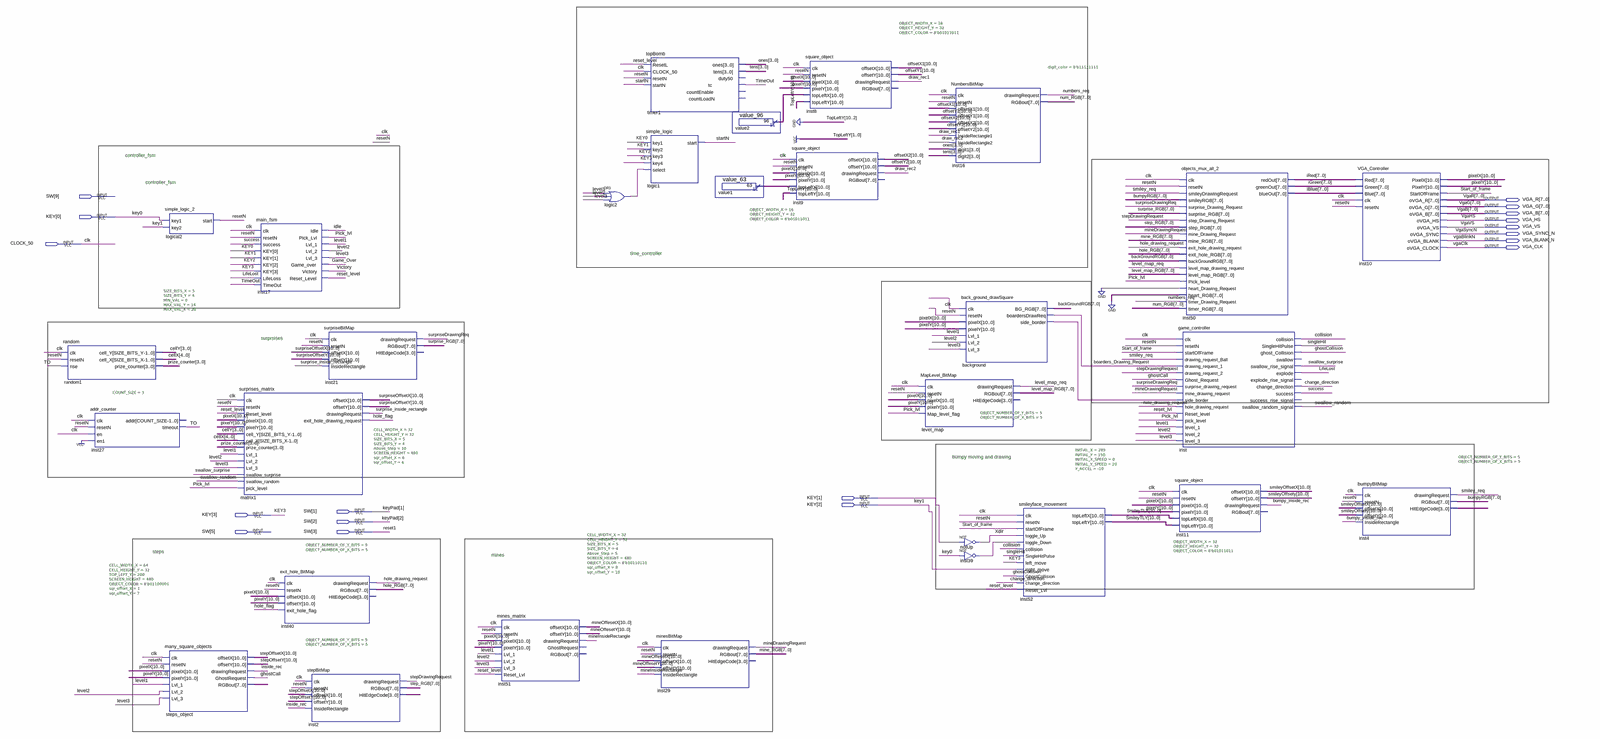
[diagram p0: schematic sheet, whole]
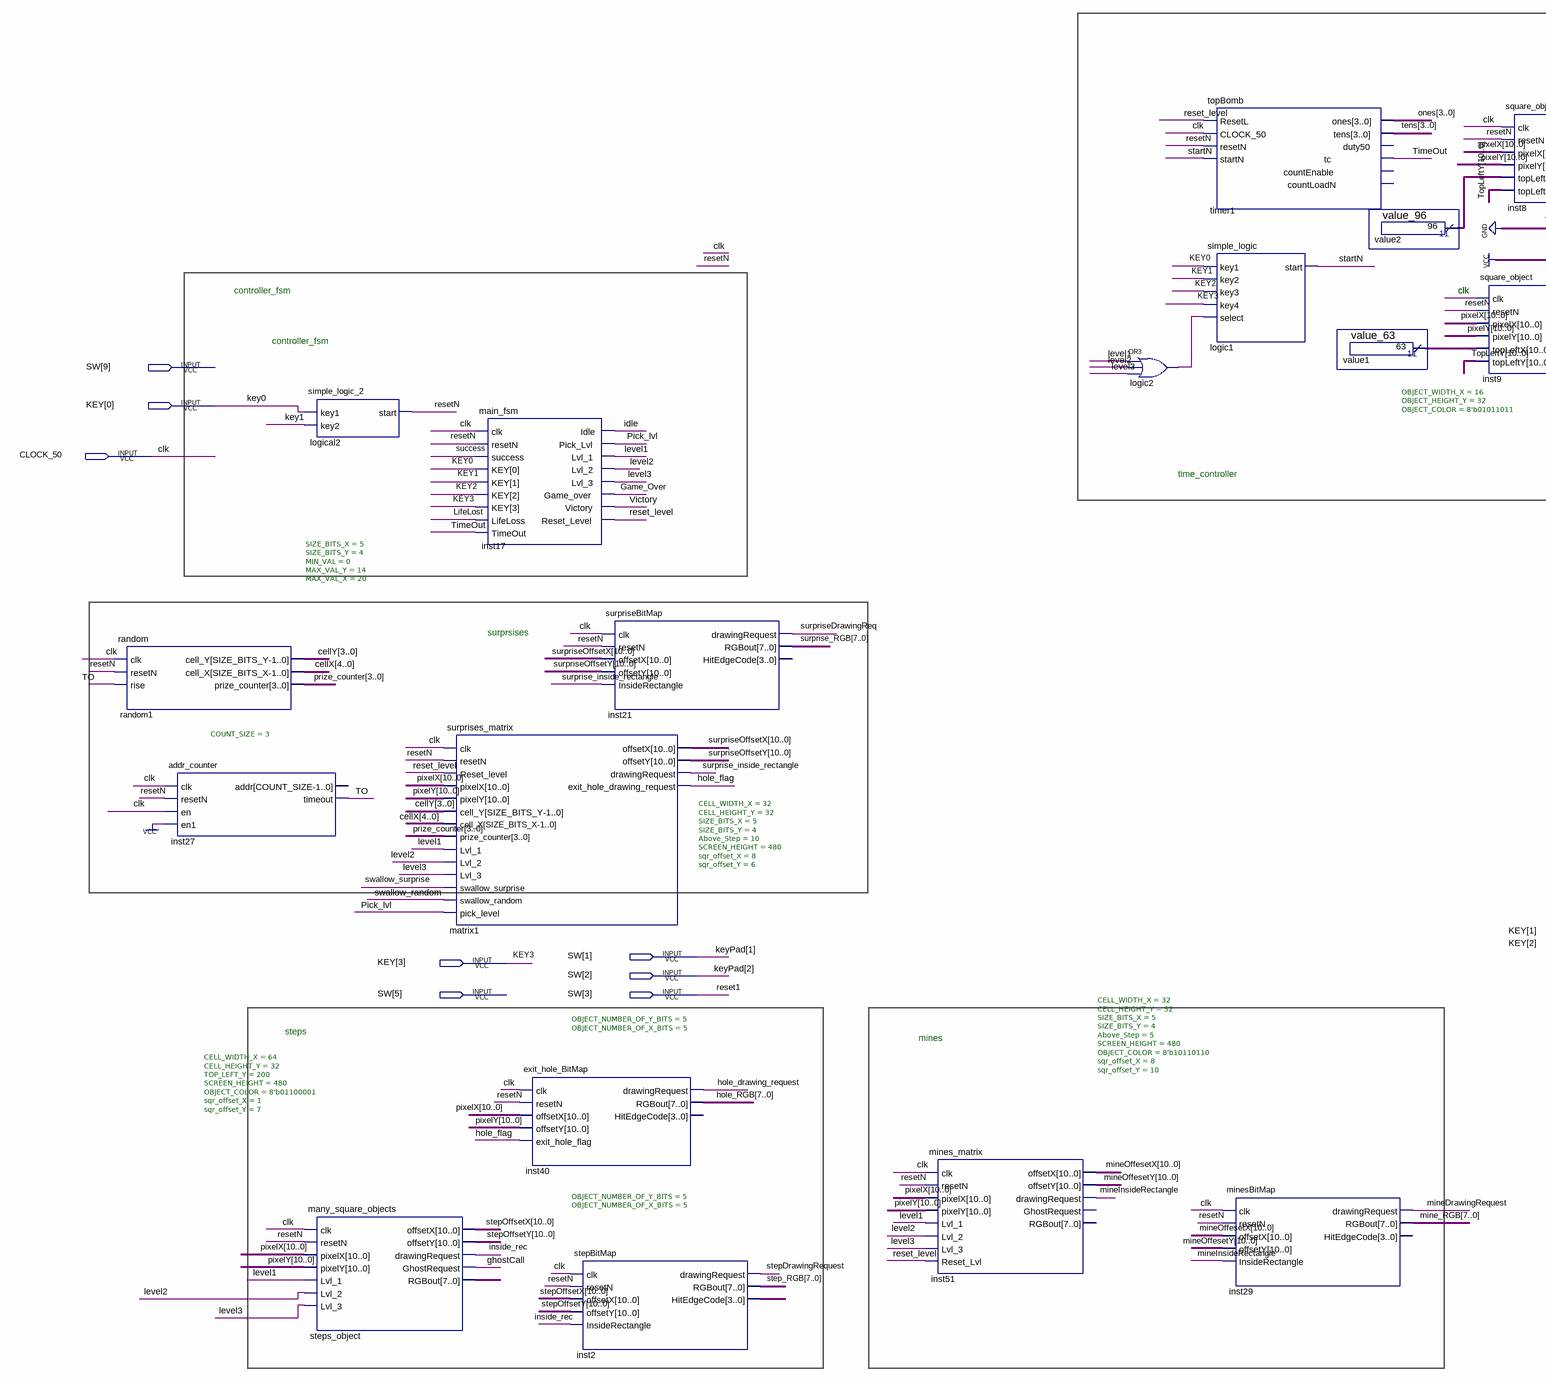
[diagram p1: schematic sheet, left part]
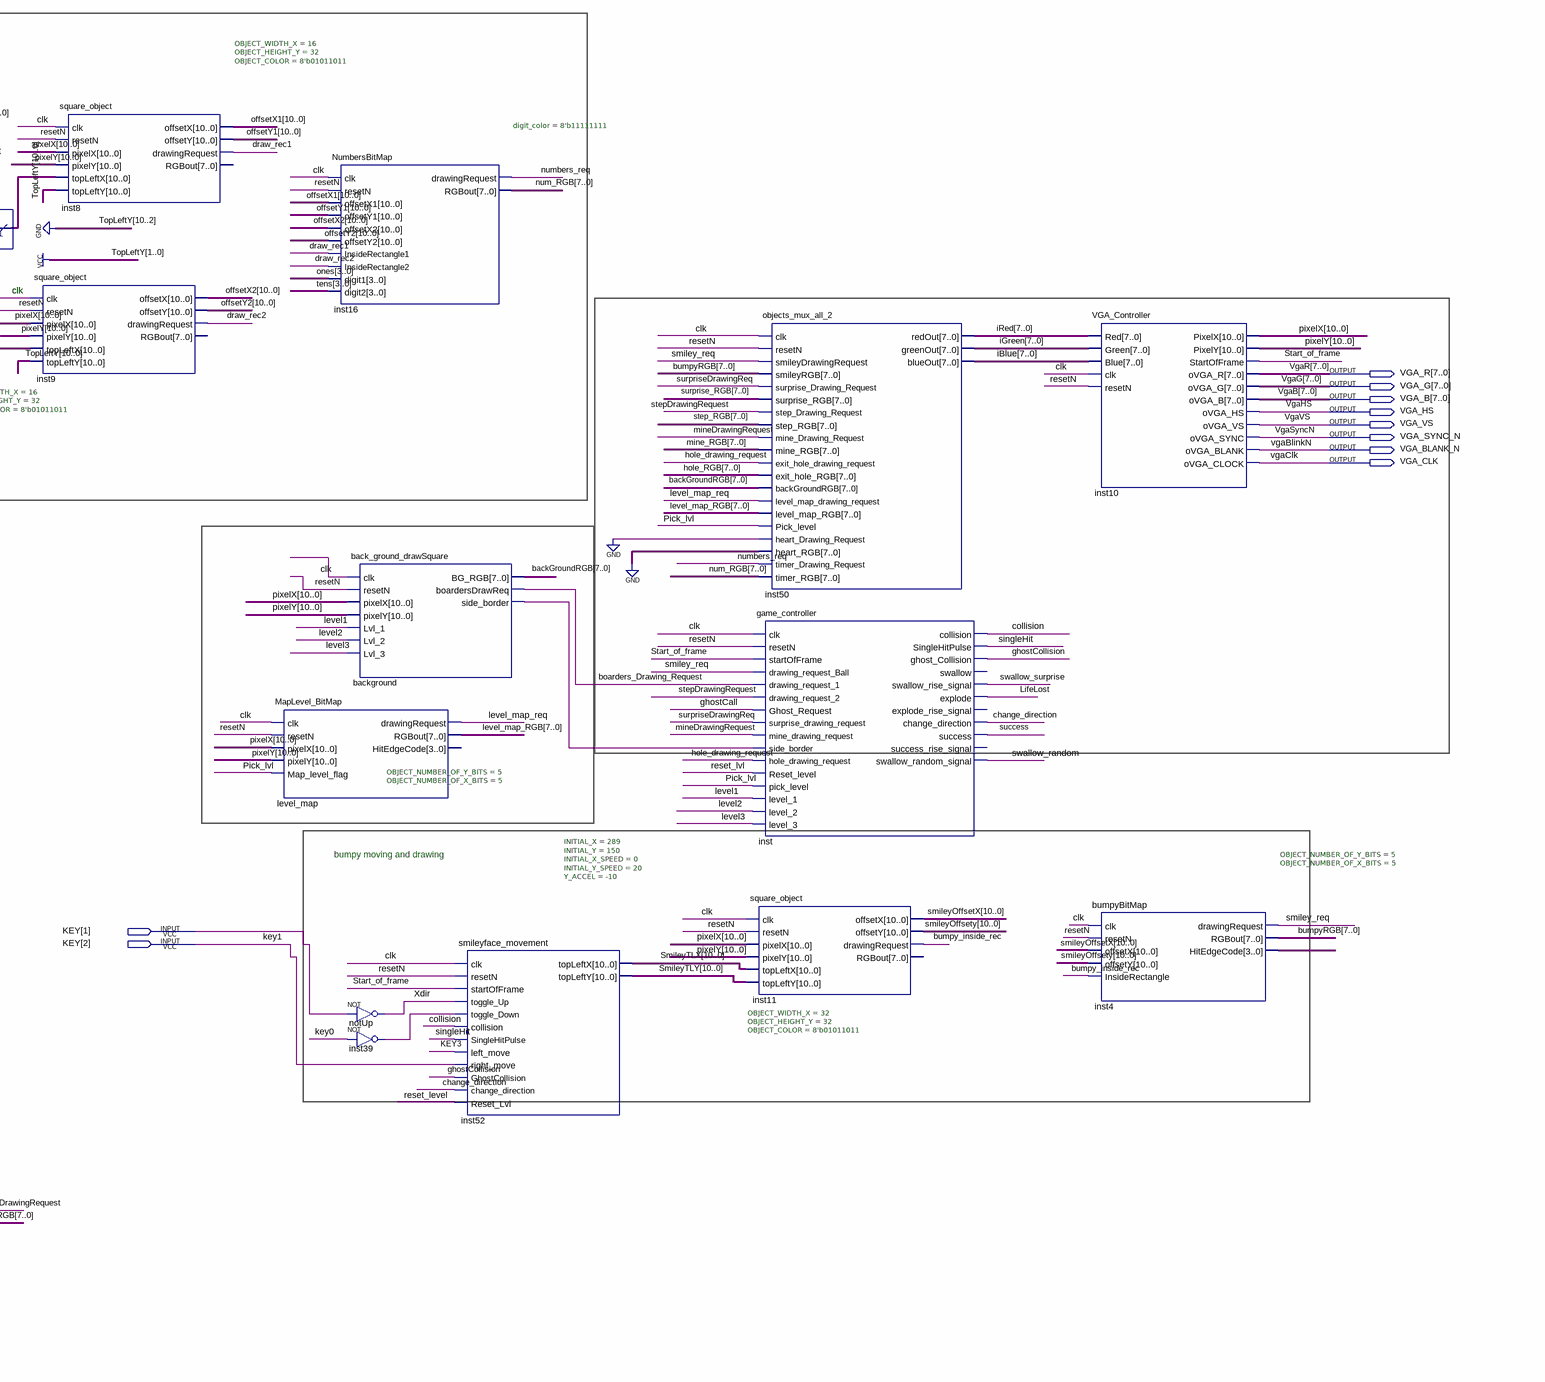
[diagram p2: schematic sheet, right part]
// Quartus schematic bumpyfinal.bdf as structural Verilog: 29 symbols, 18 pins
module bumpyfinal (
  input  [9:1] SW,
  input  [3:0] KEY,
  input  CLOCK_50,
  output [7:0] VGA_R,
  output [7:0] VGA_G,
  output [7:0] VGA_B,
  output VGA_HS,
  output VGA_VS,
  output VGA_SYNC_N,
  output VGA_BLANK_N,
  output VGA_CLK
);

  wire background_side_border, boarders_Drawing_Request, bumpy_inside_rec, change_direction, collision,
       draw_rec1, draw_rec2, Game_Over, ghostCall, ghostCollision, hole_drawing_request, hole_flag, idle,
       inside_rec, inst39_out, level1, level2, level3, level_map_req, LifeLost, logic2_out,
       mineDrawingRequest, mineInsideRectangle, numbers_req, Pick_lvl, reset_level, reset_lvl, resetN,
       singleHit, smiley_req, Start_of_frame, startN, stepDrawingRequest, success, surprise_inside_rectangle,
       surpriseDrawingReq, swallow_random, swallow_surprise, TimeOut, TO, Victory, Xdir;
  wire [3:0] cellY, inst2_hitedgecode, inst4_hitedgecode, ones, prize_counter, tens;
  wire [4:0] cellX;
  wire [7:0] backGroundRGB, bumpyRGB, hole_RGB, iBlue, iGreen, iRed, level_map_RGB, mine_RGB, num_RGB,
       step_RGB, steps_object_rgbout, surprise_RGB;
  wire [10:0] mineOffesetX, mineOffesetY, offsetX1, offsetX2, offsetY1, offsetY2, pixelX, pixelY,
       smileyOffsetX, smileyOffsety, SmileyTLX, SmileyTLY, stepOffsetX, stepOffsetY, surpriseOffsetX,
       surpriseOffsetY, value1_result, value2_result;

  random #(.SIZE_BITS_X(5), .SIZE_BITS_Y(4), .MIN_VAL(0), .MAX_VAL_Y(14), .MAX_VAL_X(20)) random1 (
    .clk(CLOCK_50), .resetN(resetN), .rise(TO), .cell_Y(cellY), .cell_X(cellX), .prize_counter(prize_counter));
  addr_counter #(.COUNT_SIZE(3)) inst27 (
    .clk(CLOCK_50), .resetN(resetN), .en(CLOCK_50), .en1(1'b1), .timeout(TO));  // open: addr
  simple_logic_2 logical2 (.key1(KEY[0]), .key2(KEY[1]), .start(resetN));
  many_square_objects #(.CELL_WIDTH_X(64), .CELL_HEIGHT_Y(32), .TOP_LEFT_Y(200), .SCREEN_HEIGHT(480), .OBJECT_COLOR(8'b01100001), .sqr_offset_X(1), .sqr_offset_Y(7)) steps_object (
    .clk(CLOCK_50), .resetN(resetN), .pixelX(pixelX), .pixelY(pixelY), .Lvl_1(level1), .Lvl_2(level2),
    .Lvl_3(level3), .offsetX(stepOffsetX), .offsetY(stepOffsetY), .drawingRequest(inside_rec),
    .GhostRequest(ghostCall), .RGBout(steps_object_rgbout));
  main_fsm inst17 (
    .clk(CLOCK_50), .resetN(resetN), .success(success), .KEY(KEY), .LifeLoss(LifeLost), .TimeOut(TimeOut),
    .Idle(idle), .Pick_Lvl(Pick_lvl), .Lvl_1(level1), .Lvl_2(level2), .Lvl_3(level3), .Game_over(Game_Over),
    .Victory(Victory), .Reset_Level(reset_level));
  surprises_matrix #(.CELL_WIDTH_X(32), .CELL_HEIGHT_Y(32), .SIZE_BITS_X(5), .SIZE_BITS_Y(4), .Above_Step(10), .SCREEN_HEIGHT(480), .sqr_offset_X(8), .sqr_offset_Y(6)) matrix1 (
    .clk(CLOCK_50), .resetN(resetN), .Reset_level(reset_level), .pixelX(pixelX), .pixelY(pixelY),
    .cell_Y(cellY), .cell_X(cellX), .prize_counter(prize_counter), .Lvl_1(level1), .Lvl_2(level2),
    .Lvl_3(level3), .swallow_surprise(swallow_surprise), .swallow_random(swallow_random),
    .pick_level(Pick_lvl), .offsetX(surpriseOffsetX), .offsetY(surpriseOffsetY),
    .drawingRequest(surprise_inside_rectangle), .exit_hole_drawing_request(hole_flag));
  exit_hole_BitMap #(.OBJECT_NUMBER_OF_Y_BITS(5), .OBJECT_NUMBER_OF_X_BITS(5)) inst40 (
    .clk(CLOCK_50), .resetN(resetN), .offsetX(pixelX), .offsetY(pixelY), .exit_hole_flag(hole_flag),
    .drawingRequest(hole_drawing_request), .RGBout(hole_RGB));  // open: HitEdgeCode
  stepBitMap #(.OBJECT_NUMBER_OF_Y_BITS(5), .OBJECT_NUMBER_OF_X_BITS(5)) inst2 (
    .clk(CLOCK_50), .resetN(resetN), .offsetX(stepOffsetX), .offsetY(stepOffsetY),
    .InsideRectangle(inside_rec), .drawingRequest(stepDrawingRequest), .RGBout(step_RGB),
    .HitEdgeCode(inst2_hitedgecode));
  surpriseBitMap inst21 (
    .clk(CLOCK_50), .resetN(resetN), .offsetX(surpriseOffsetX), .offsetY(surpriseOffsetY),
    .InsideRectangle(surprise_inside_rectangle), .drawingRequest(surpriseDrawingReq), .RGBout(surprise_RGB));  // open: HitEdgeCode
  mines_matrix #(.CELL_WIDTH_X(32), .CELL_HEIGHT_Y(32), .SIZE_BITS_X(5), .SIZE_BITS_Y(4), .Above_Step(5), .SCREEN_HEIGHT(480), .OBJECT_COLOR(8'b10110110), .sqr_offset_X(8), .sqr_offset_Y(10)) inst51 (
    .clk(CLOCK_50), .resetN(resetN), .pixelX(pixelX), .pixelY(pixelY), .Lvl_1(level1), .Lvl_2(level2),
    .Lvl_3(level3), .Reset_Lvl(reset_level), .offsetX(mineOffesetX), .offsetY(mineOffesetY),
    .drawingRequest(mineInsideRectangle));  // open: GhostRequest, RGBout
  or logic2 (logic2_out, level1, level2, level3);
  topBomb timer1 (
    .ResetL(reset_level), .CLOCK_50(CLOCK_50), .resetN(resetN), .startN(startN), .ones(ones), .tens(tens),
    .tc(TimeOut));  // open: duty50, countEnable, countLoadN
  simple_logic logic1 (.key1(KEY[0]), .key2(KEY[1]), .key3(KEY[2]), .key4(KEY[3]), .select(logic2_out), .start(startN));
  minesBitMap inst29 (
    .clk(CLOCK_50), .resetN(resetN), .offsetX(mineOffesetX), .offsetY(mineOffesetY),
    .InsideRectangle(mineInsideRectangle), .drawingRequest(mineDrawingRequest), .RGBout(mine_RGB));  // open: HitEdgeCode
  value_63 value1 (.result(value1_result));
  value_96 value2 (.result(value2_result));
  square_object #(.OBJECT_WIDTH_X(16), .OBJECT_HEIGHT_Y(32), .OBJECT_COLOR(8'b01011011)) inst9 (
    .clk(CLOCK_50), .resetN(resetN), .pixelX(pixelX), .pixelY(pixelY), .topLeftX(value1_result),
    .topLeftY(11'b00000000011), .offsetX(offsetX2), .offsetY(offsetY2), .drawingRequest(draw_rec2));  // open: RGBout
  square_object #(.OBJECT_WIDTH_X(16), .OBJECT_HEIGHT_Y(32), .OBJECT_COLOR(8'b01011011)) inst8 (
    .clk(CLOCK_50), .resetN(resetN), .pixelX(pixelX), .pixelY(pixelY), .topLeftX(value2_result),
    .topLeftY(11'b00000000011), .offsetX(offsetX1), .offsetY(offsetY1), .drawingRequest(draw_rec1));  // open: RGBout
  MapLevel_BitMap #(.OBJECT_NUMBER_OF_Y_BITS(5), .OBJECT_NUMBER_OF_X_BITS(5)) level_map (
    .clk(CLOCK_50), .resetN(resetN), .pixelX(pixelX), .pixelY(pixelY), .Map_level_flag(Pick_lvl),
    .drawingRequest(level_map_req), .RGBout(level_map_RGB));  // open: HitEdgeCode
  NumbersBitMap #(.digit_color(8'b11111111)) inst16 (
    .clk(CLOCK_50), .resetN(resetN), .offsetX1(offsetX1), .offsetY1(offsetY1), .offsetX2(offsetX2),
    .offsetY2(offsetY2), .InsideRectangle1(draw_rec1), .InsideRectangle2(draw_rec2), .digit1(ones),
    .digit2(tens), .drawingRequest(numbers_req), .RGBout(num_RGB));
  back_ground_drawSquare background (
    .clk(CLOCK_50), .resetN(resetN), .pixelX(pixelX), .pixelY(pixelY), .Lvl_1(level1), .Lvl_2(level2),
    .Lvl_3(level3), .BG_RGB(backGroundRGB), .boardersDrawReq(boarders_Drawing_Request),
    .side_border(background_side_border));
  not notUp (Xdir, KEY[1]);
  not inst39 (inst39_out, KEY[0]);
  smileyface_movement #(.INITIAL_X(289), .INITIAL_Y(150), .INITIAL_X_SPEED(0), .INITIAL_Y_SPEED(20), .Y_ACCEL(-10)) inst52 (
    .clk(CLOCK_50), .resetN(resetN), .startOfFrame(Start_of_frame), .toggle_Up(Xdir),
    .toggle_Down(inst39_out), .collision(collision), .SingleHitPulse(singleHit), .left_move(KEY[3]),
    .right_move(KEY[2]), .GhostCollision(ghostCollision), .change_direction(change_direction),
    .Reset_Lvl(reset_level), .topLeftX(SmileyTLX), .topLeftY(SmileyTLY));
  objects_mux_all_2 inst50 (
    .clk(CLOCK_50), .resetN(resetN), .smileyDrawingRequest(smiley_req), .smileyRGB(bumpyRGB),
    .surprise_Drawing_Request(surpriseDrawingReq), .surprise_RGB(surprise_RGB),
    .step_Drawing_Request(stepDrawingRequest), .step_RGB(step_RGB),
    .mine_Drawing_Request(mineDrawingRequest), .mine_RGB(mine_RGB),
    .exit_hole_drawing_request(hole_drawing_request), .exit_hole_RGB(hole_RGB),
    .backGroundRGB(backGroundRGB), .level_map_drawing_request(level_map_req), .level_map_RGB(level_map_RGB),
    .Pick_level(Pick_lvl), .heart_Drawing_Request(1'b0), .heart_RGB({8{1'b0}}),
    .timer_Drawing_Request(numbers_req), .timer_RGB(num_RGB), .redOut(iRed), .greenOut(iGreen),
    .blueOut(iBlue));
  game_controller inst (
    .clk(CLOCK_50), .resetN(resetN), .startOfFrame(Start_of_frame), .drawing_request_Ball(smiley_req),
    .drawing_request_1(boarders_Drawing_Request), .drawing_request_2(stepDrawingRequest),
    .Ghost_Request(ghostCall), .surprise_drawing_request(surpriseDrawingReq),
    .mine_drawing_request(mineDrawingRequest), .side_border(background_side_border),
    .hole_drawing_request(hole_drawing_request), .Reset_level(reset_lvl), .pick_level(Pick_lvl),
    .level_1(level1), .level_2(level2), .level_3(level3), .collision(collision), .SingleHitPulse(singleHit),
    .ghost_Collision(ghostCollision), .swallow_rise_signal(swallow_surprise), .explode(LifeLost),
    .change_direction(change_direction), .success(success), .swallow_random_signal(swallow_random));  // open: swallow, explode_rise_signal, success_rise_signal
  square_object #(.OBJECT_WIDTH_X(32), .OBJECT_HEIGHT_Y(32), .OBJECT_COLOR(8'b01011011)) inst11 (
    .clk(CLOCK_50), .resetN(resetN), .pixelX(pixelX), .pixelY(pixelY), .topLeftX(SmileyTLX),
    .topLeftY(SmileyTLY), .offsetX(smileyOffsetX), .offsetY(smileyOffsety), .drawingRequest(bumpy_inside_rec));  // open: RGBout
  VGA_Controller inst10 (
    .Red(iRed), .Green(iGreen), .Blue(iBlue), .clk(CLOCK_50), .resetN(resetN), .PixelX(pixelX),
    .PixelY(pixelY), .StartOfFrame(Start_of_frame), .oVGA_R(VGA_R), .oVGA_G(VGA_G), .oVGA_B(VGA_B),
    .oVGA_HS(VGA_HS), .oVGA_VS(VGA_VS), .oVGA_SYNC(VGA_SYNC_N), .oVGA_BLANK(VGA_BLANK_N), .oVGA_CLOCK(VGA_CLK));
  bumpyBitMap #(.OBJECT_NUMBER_OF_Y_BITS(5), .OBJECT_NUMBER_OF_X_BITS(5)) inst4 (
    .clk(CLOCK_50), .resetN(resetN), .offsetX(smileyOffsetX), .offsetY(smileyOffsety),
    .InsideRectangle(bumpy_inside_rec), .drawingRequest(smiley_req), .RGBout(bumpyRGB),
    .HitEdgeCode(inst4_hitedgecode));

  // Other names for the same wires on the sheet: clk = CLOCK_50; keyPad[2:1] = SW[2:1]; reset1 = SW[3];
  //   VgaB[7:0] = VGA_B; vgaBlinkN = VGA_BLANK_N; vgaClk = VGA_CLK; VgaG[7:0] = VGA_G; VgaHS = VGA_HS;
  //   VgaR[7:0] = VGA_R; VgaSyncN = VGA_SYNC_N; VgaVS = VGA_VS

  // Notes on the sheet:
  //   controller_fsm
  //   clk
  //   controller_fsm
  //   time_controller
  //   surprsises
  //   bumpy moving and drawing
  //   steps
  //   mines
endmodule
